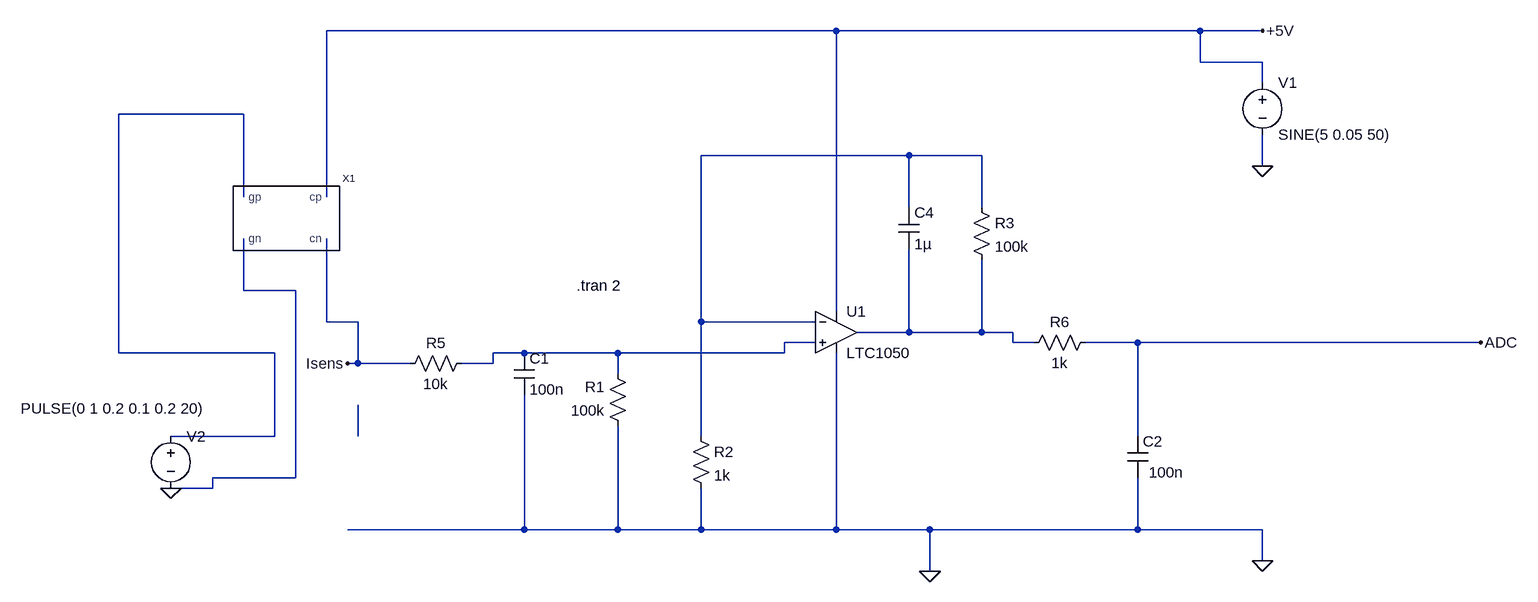
[diagram p0: schematic Draftfinal.asc]
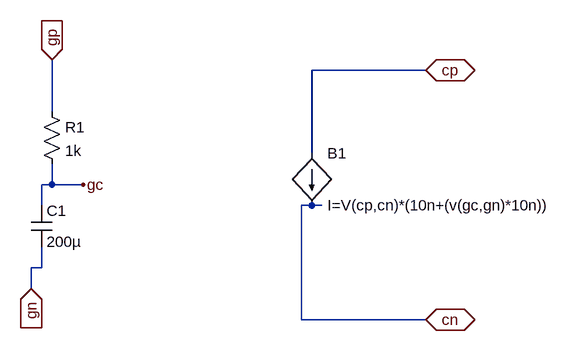
[diagram p1: sub-circuit capteurgaz.asc]
Draftfinal.asc, the LTspice schematic file:
Version 4
SHEET 1 1748 680
WIRE 688 -352 -96 -352
WIRE 1248 -352 688 -352
WIRE 1344 -352 1248 -352
WIRE 1248 -304 1248 -352
WIRE 1344 -304 1248 -304
WIRE 1344 -272 1344 -304
WIRE -224 -224 -416 -224
WIRE 800 -160 480 -160
WIRE 912 -160 800 -160
WIRE 1344 -144 1344 -192
WIRE -224 -96 -224 -224
WIRE -96 -96 -96 -352
WIRE 800 -80 800 -160
WIRE 912 -80 912 -160
WIRE -224 48 -224 -32
WIRE -144 48 -224 48
WIRE 688 80 688 -352
WIRE -96 96 -96 -32
WIRE -48 96 -96 96
WIRE 480 96 480 -160
WIRE 656 96 480 96
WIRE 800 112 800 -16
WIRE 800 112 720 112
WIRE 912 112 912 0
WIRE 912 112 800 112
WIRE 960 112 912 112
WIRE 656 128 608 128
WIRE 960 128 960 112
WIRE 992 128 960 128
WIRE 1152 128 1072 128
WIRE 1680 128 1152 128
WIRE -416 144 -416 -224
WIRE -176 144 -416 144
WIRE 208 144 160 144
WIRE 352 144 208 144
WIRE 608 144 608 128
WIRE 608 144 352 144
WIRE -48 160 -48 96
WIRE -48 160 -64 160
WIRE 32 160 -48 160
WIRE 160 160 160 144
WIRE 160 160 112 160
WIRE 352 176 352 144
WIRE -176 272 -176 144
WIRE -176 272 -336 272
WIRE -48 272 -48 224
WIRE 480 272 480 96
WIRE 1152 272 1152 128
WIRE -144 336 -144 48
WIRE -144 336 -272 336
WIRE -272 352 -272 336
WIRE -272 352 -336 352
WIRE 208 416 208 208
WIRE 208 416 -64 416
WIRE 352 416 352 256
WIRE 352 416 208 416
WIRE 480 416 480 352
WIRE 480 416 352 416
WIRE 688 416 688 144
WIRE 688 416 480 416
WIRE 832 416 688 416
WIRE 1152 416 1152 336
WIRE 1152 416 832 416
WIRE 1344 416 1152 416
WIRE 1344 464 1344 416
WIRE 832 480 832 416
FLAG 1344 464 0
FLAG 832 480 0
FLAG 1680 128 ADC
FLAG -64 160 Isens
FLAG 1344 -352 +5V
FLAG 1344 -144 0
FLAG -336 352 0
SYMBOL res 128 144 R90
WINDOW 0 0 56 VBottom 2
WINDOW 3 32 56 VTop 2
SYMATTR InstName R5
SYMATTR Value 10k
SYMBOL res 368 272 R180
WINDOW 0 36 76 Left 2
WINDOW 3 36 40 Left 2
SYMATTR InstName R1
SYMATTR Value 100k
SYMBOL res 896 -96 R0
SYMATTR InstName R3
SYMATTR Value 100k
SYMBOL res 1088 112 R90
WINDOW 0 0 56 VBottom 2
WINDOW 3 32 56 VTop 2
SYMATTR InstName R6
SYMATTR Value 1k
SYMBOL cap 192 144 R0
SYMATTR InstName C1
SYMATTR Value 100n
SYMBOL cap 784 -80 R0
SYMATTR InstName C4
SYMATTR Value 1µ
SYMBOL cap 1136 272 R0
WINDOW 3 33 56 Left 2
SYMATTR Value 100n
SYMATTR InstName C2
SYMBOL Opamps\\LTC1050 688 48 R0
SYMATTR InstName U1
SYMBOL res 464 256 R0
SYMATTR InstName R2
SYMATTR Value 1k
SYMBOL voltage 1344 -288 R0
WINDOW 123 0 0 Left 2
WINDOW 39 0 0 Left 2
SYMATTR InstName V1
SYMATTR Value SINE(5 0.05 50)
SYMBOL capteurgaz -160 -96 R0
SYMATTR InstName X1
SYMBOL voltage -336 256 R0
WINDOW 3 -231 -27 Left 2
WINDOW 123 0 0 Left 2
WINDOW 39 0 0 Left 2
SYMATTR Value PULSE(0 1 0.2 0.1 0.2 20)
SYMATTR InstName V2
TEXT 288 40 Left 2 !.tran 2

capteurgaz.asc, the sub-circuit schematic file:
Version 4
SHEET 1 880 680
WIRE 528 16 352 16
WIRE -48 80 -48 0
WIRE 352 144 352 16
WIRE -48 192 -48 160
WIRE -48 192 -64 192
WIRE 0 192 -48 192
WIRE -64 224 -64 192
WIRE 352 224 336 224
WIRE 368 224 352 224
WIRE -64 320 -64 288
WIRE -64 320 -80 320
WIRE -80 352 -80 320
WIRE 336 400 336 224
WIRE 528 400 336 400
FLAG -48 0 gp
IOPIN -48 0 In
FLAG -80 352 gn
IOPIN -80 352 In
FLAG 0 192 gc
FLAG 528 16 cp
IOPIN 528 16 BiDir
FLAG 528 400 cn
IOPIN 528 400 BiDir
SYMBOL res -64 64 R0
SYMATTR InstName R1
SYMATTR Value 1k
SYMBOL cap -80 224 R0
SYMATTR InstName C1
SYMATTR Value 200µ
SYMBOL bi 352 144 R0
SYMATTR InstName B1
SYMATTR Value I=V(cp,cn)*(10n+(v(gc,gn)*10n))

The netlist it stands for:
* Draftfinal.asc
R5 N004 Isens 10k
R1 0 N004 100k
R3 N002 N003 100k
R6 ADC N003 1k
C1 N004 0 100n
C4 N002 N003 1µ
C2 ADC 0 100n
XU1 N004 N002 +5V 0 N003 LTC1050  ; pins In+ In- V+ V- OUT
R2 N002 0 1k
V1 +5V 0 SINE(5 0.05 50)
XX1 N001 0 +5V Isens capteurgaz
V2 N001 0 PULSE(0 1 0.2 0.1 0.2 20)

* block symbol definitions
.subckt capteurgaz gp gn cp cn
R1 gp gc 1k
C1 gc gn 200µ
B1 cp cn I=V(cp,cn)*(10n+(v(gc,gn)*10n))
.ends capteurgaz

.tran 2
.lib LTC.lib
.backanno
.end